# Altium project stm32底盘_PCB_V1.0.PrjPcb
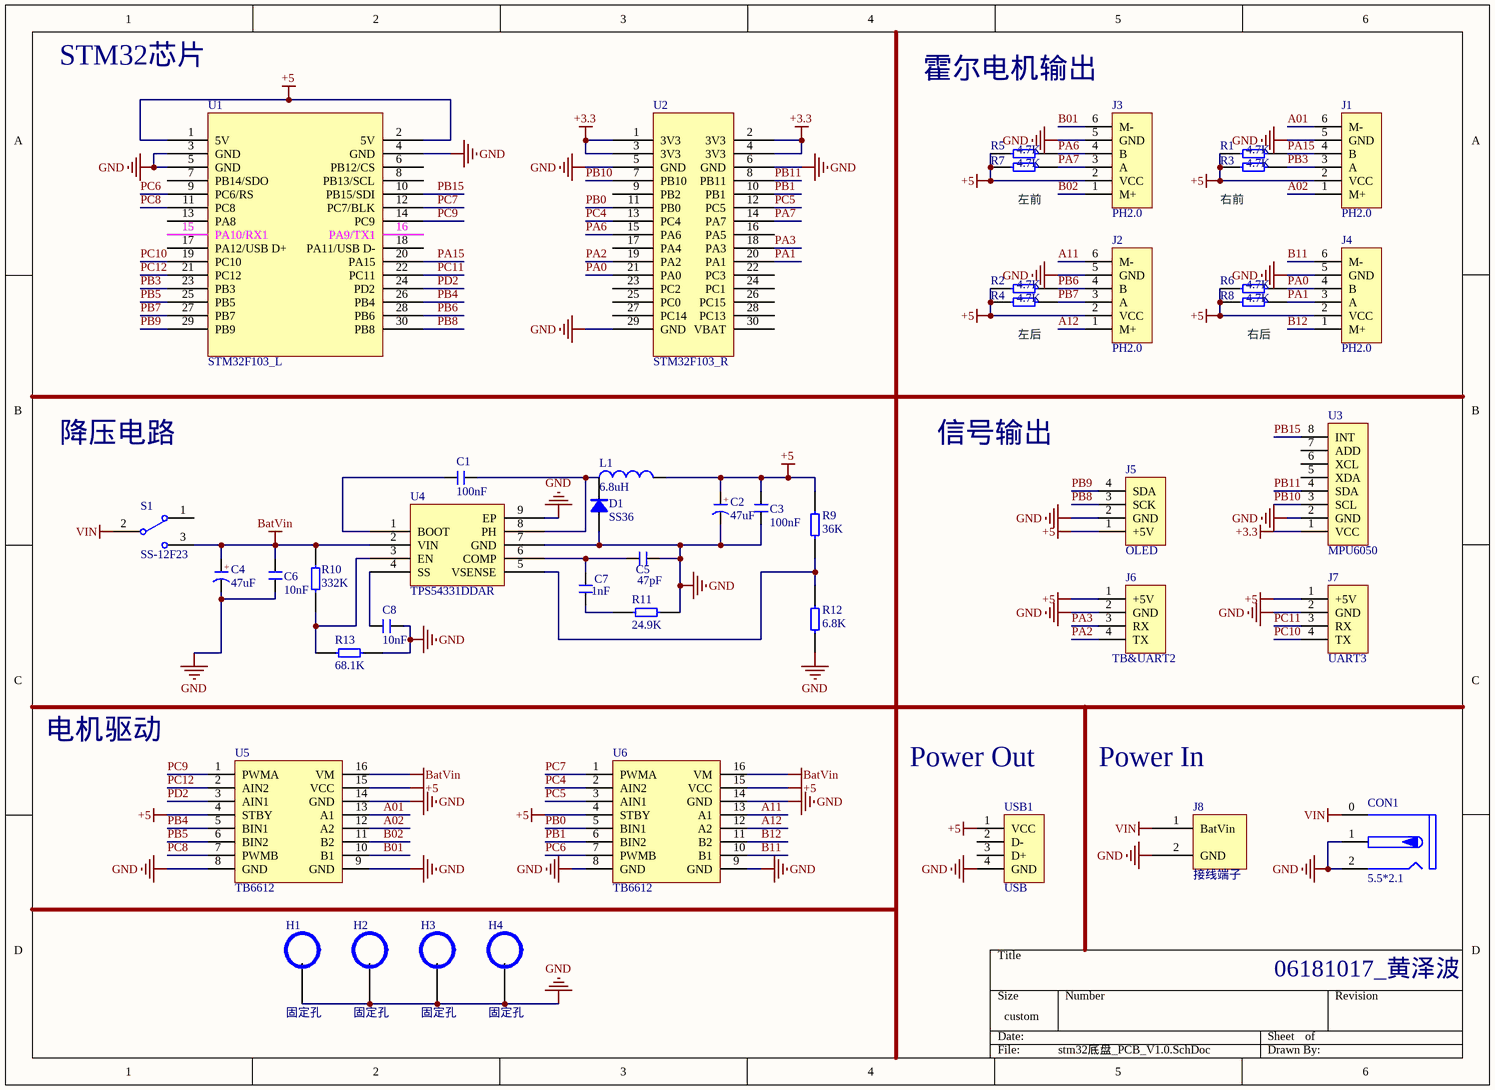
[diagram p0: stm32底盘_PCB_V1.0.SchDoc]
1 sheet, 44 parts. Net scope: global (net labels, ports and power ports of the same name join across sheets).
Board file: stm32底盘_PCB_V1.0.PcbDoc

## Sheet stm32底盘_PCB_V1.0.SchDoc
size 279 x 203 mm; Author: bobo; DrawnBy: 06181017_黄泽波

### Parts
C1  100nF  [C 0603_L]
C2  47uF  [CS 2.5*6.3*7 - C]
C3  100nF  [C 0603_M]
C4  47uF  [CS 2.5*6.3*7 - C]
C5  47pF  [C 0603_L]
C6  10nF  [C 0603_L]
C7  1nF  [C 0603_L]
C8  10nF  [C 0603_L]
CON1  5.5*2.1  [DC-005]
D1  SS36  [SMA]
H1  固定孔  [铜柱孔]
H2  固定孔  [铜柱孔]
H3  固定孔  [铜柱孔]
H4  固定孔  [铜柱孔]
J1  PH2.0  [PH2.0-LI-6P]
J2  PH2.0  [PH2.0-LI-6P]
J3  PH2.0  [PH2.0-LI-6P]
J4  PH2.0  [PH2.0-LI-6P]
J5  OLED  [OELD MODULE 1.9]
J6  TB&UART2  [TB&UART2]
J7  UART3  [UART3]
J8  接线端子  [KF128-5.08-2P]
L1  6.8uH  [CDRH73]
R1  4.7K  [R 0603_M]
R2  4.7K  [R 0603_M]
R3  4.7K  [R 0603_M]
R4  4.7K  [R 0603_M]
R5  4.7K  [R 0603_M]
R6  4.7K  [R 0603_M]
R7  4.7K  [R 0603_M]
R8  4.7K  [R 0603_M]
R9  36K  [R 0603_M]
R10  332K  [R 0603_M]
R11  24.9K  [R 0603_M]
R12  6.8K  [R 0603_M]
R13  68.1K  [R 0603_M]
S1  SS-12F23  [SS-12D10]
U1  STM32F103_L  [STM32F103_L]
U2  STM32F103_R  [STM32F103_R]
U3  MPU6050  [MPU6050]
U4  TPS54331DDAR  [SOP8_M]
U5  TB6612  [TB6612]
U6  TB6612  [TB6612]
USB1  USB  [USB-A/S_A]

### Nets
+3.3: U2.1(3V3) U2.2(3V3) U2.3(3V3) U2.4(3V3) U3.1(VCC)
+5: C2.1(A) C3.2 J1.2(VCC) J2.2(VCC) J3.2(VCC) J4.2(VCC) J5.1(+5V) J6.1(+5V) J7.1(+5V) L1.2 R1.1 R2.1 R3.1 R4.1 R5.1 R6.1 R7.1 R8.1 R9.2 U1.1(5V) U1.2(5V) U5.4(STBY) U5.15(VCC) U6.4(STBY) U6.15(VCC) USB1.1(VCC)
BatVin: C4.1(A) C6.2 R10.1 S1.3 U4.2(VIN) U5.16(VM) U6.16(VM)
GND: C2.2(K) C3.1 C4.2(K) C5.1 C6.1 C8.1 CON1.1 CON1.2 D1.1(A) H1.11 H2.11 H3.11 H4.11 J1.5(GND) J2.5(GND) J3.5(GND) J4.5(GND) J5.2(GND) J6.2(GND) J7.2(GND) J8.2(GND) R11.2 R12.1 R13.2 U1.3(GND) U1.4(GND) U1.5(GND) U2.5(GND) U2.6(GND) U2.29(GND) U3.2(GND) U4.7(GND) U4.9(EP) U5.8(GND) U5.9(GND) U5.14(GND) U6.8(GND) U6.9(GND) U6.14(GND) USB1.4(GND)
VIN: CON1.0 J8.1(BatVin) S1.2
A01: J1.6(M-) U5.13(A1)
A02: J1.1(M+) U5.12(A2)
A11: J2.6(M-) U6.13(A1)
A12: J2.1(M+) U6.12(A2)
B01: J3.6(M-) U5.10(B1)
B02: J3.1(M+) U5.11(B2)
B11: J4.6(M-) U6.10(B1)
B12: J4.1(M+) U6.11(B2)
PA0: J4.4(B) R6.2 U2.21(PA0)
PA1: J4.3(A) R8.2 U2.20(PA1)
PA2: J6.4(TX) U2.19(PA2)
PA3: J6.3(RX) U2.18(PA3)
PA6: J3.4(B) R5.2 U2.15(PA6)
PA7: J3.3(A) R7.2 U2.14(PA7)
PA15: J1.4(B) R1.2 U1.20(PA15)
PB0: U2.11(PB0) U6.5(BIN1)
PB1: U2.10(PB1) U6.6(BIN2)
PB3: J1.3(A) R3.2 U1.23(PB3)
PB4: U1.26(PB4) U5.5(BIN1)
PB5: U1.25(PB5) U5.6(BIN2)
PB6: J2.4(B) R2.2 U1.28(PB6)
PB7: J2.3(A) R4.2 U1.27(PB7)
PB8: J5.3(SCK) U1.30(PB8)
PB9: J5.4(SDA) U1.29(PB9)
PB10: U2.7(PB10) U3.3(SCL)
PB11: U2.8(PB11) U3.4(SDA)
PB15: U1.10(PB15/SDI) U3.8(INT)
PC4: U2.13(PC4) U6.2(AIN2)
PC5: U2.12(PC5) U6.3(AIN1)
PC6: U1.9(PC6/RS) U6.7(PWMB)
PC7: U1.12(PC7/BLK) U6.1(PWMA)
PC8: U1.11(PC8) U5.7(PWMB)
PC9: U1.14(PC9) U5.1(PWMA)
PC10: J7.4(TX) U1.19(PC10)
PC11: J7.3(RX) U1.22(PC11)
PC12: U1.21(PC12) U5.2(AIN2)
PD2: U1.24(PD2) U5.3(AIN1)
NetC1_1: C1.1 U4.1(BOOT)
NetC1_2: C1.2 D1.2(K) L1.1 U4.8(PH)
NetC5_2: C5.2 C7.2 U4.6(COMP)
NetC7_1: C7.1 R11.1
NetC8_2: C8.2 U4.4(SS)
NetR9_1: R9.1 R12.2 U4.5(VSENSE)
NetR10_2: R10.2 R13.1 U4.3(EN)

Not connected (* = marked no-connect by the designer): S1 1; U1 6(PB12/CS) 7(PB14/SDO) 8(PB13/SCL) 13(PA8) 15(PA10/RX1) 16(PA9/TX1) 17(PA12/USB_D+) 18(PA11/USB_D-); U2 9(PB2) 16(PA5) 17(PA4) 22(PC3) 23(PC2) 24(PC1) 25(PC0) 26(PC15) 27(PC14) 28(PC13) 30(VBAT); U3 5(XDA) 6(XCL) 7(ADD); USB1 2(D-) 3(D+)

### Notes on the sheet
- STM32芯片
- 霍尔电机输出
- 左前
- 右前
- 左后
- 右后
- 降压电路
- 信号输出
- 电机驱动
- Power Out
- Power In
- 06181017_黄泽波
- (in symbol C-CS) +

### Library data of the parts
C1 C3 C5-C8 = C: 无极性贴片电容; 材质: X7R; BOM名称: 无极性贴片电容
C2 C4 = C-CS: 直插固态电容; BOM名称: 直插固态电容
CON1 = DC-005P: 带屏蔽DC电源接口; BOM名称: 带屏蔽DC电源接口
D1 = SS36: 肖特基二极管; 属性: 40V/3A; BOM名称: 肖特基二极管
J1-J4 = PH2.0: 6脚接口
J5 = OLED: IIC
J6 = TB&UART2: 串口通信
J7 = UART3: 串口通信
J8 = T形接头: 航模电池接口
L1 = L: 小功率贴片电感; BOM名称: 小功率贴片电感
R1-R13 = Res: 电阻
S1 = SSW-1P: 1路波动开关; BOM名称: 波动开关
U1 = STM32F103_L: 32位STM单片机
U2 = STM32F103_R: 32位STM单片机
U4 = TPS54331DDAR: 压降芯片
USB1 = USB-A/S: USB-A型母接口; BOM名称: USB-A型母接口